# Altium project master-010106.PrjPcb (part 2 of 5)

## Sheet dcdc_5v0_3v3.SchDoc
size 220 x 124 mm; SheetNumber: 1; SheetTotal: 1
Used 2 times, as channels U_03_supply1/MCU_0_VCC, U_03_supply1/MCU_1_VCC. Parts and nets are listed once, with the designators drawn on the sheet.
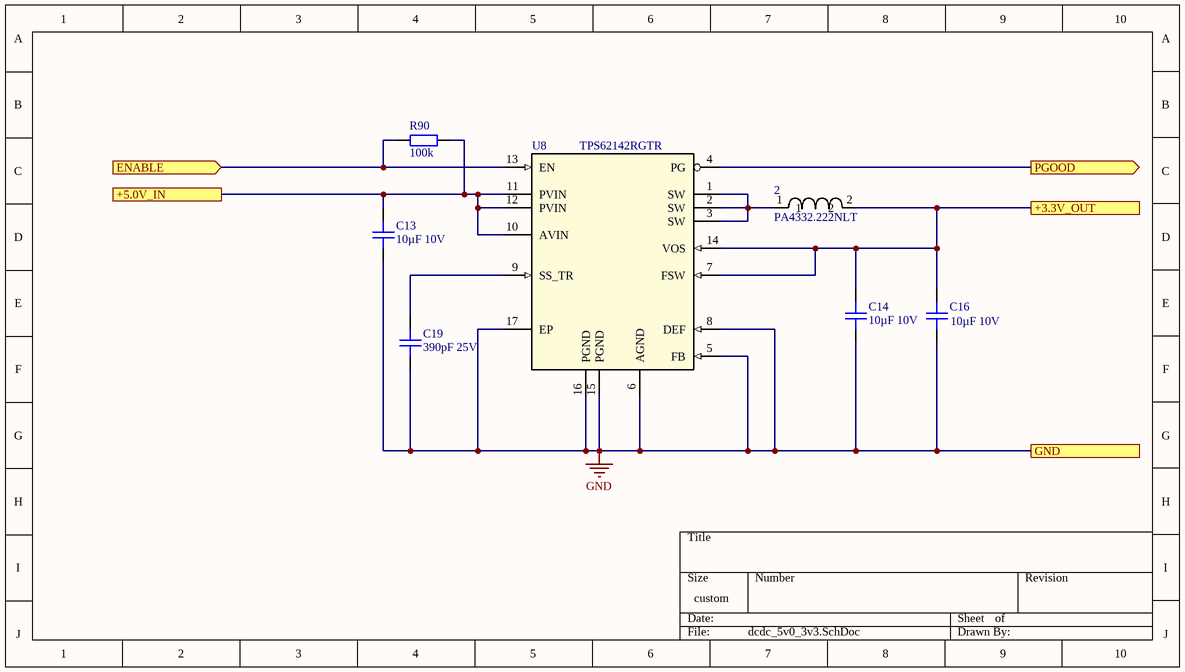
[diagram p5: dcdc_5v0_3v3.SchDoc]

### Parts
2  PA4332.222NLT  [PA4332]
C13  10µF 10V  [0805C]
C14  10µF 10V  [0805C]
C16  10µF 10V  [0805C]
C19  390pF 25V  [0402C]
R90  100k  [0603R]
U8  TPS62142RGTR  [RGT0016C]

### Ports
+3.3V_OUT, +5.0V_IN, ENABLE (in), GND, PGOOD (out)

### Nets
GND: C13.2 C14.2 C16.2 C19.1 U8.5(FB) U8.6(AGND) U8.8(DEF) U8.15(PGND) U8.16(PGND) U8.17(EP) ; port GND
+3.3V_OUT: 2.2 C14.1 C16.1 U8.7(FSW) U8.14(VOS) ; port +3.3V_OUT
+5.0V_IN: C13.1 R90.1 U8.10(AVIN) U8.11(PVIN) U8.12(PVIN) ; port +5.0V_IN
ENABLE: R90.2 U8.13(EN) ; port ENABLE
PGOOD: U8.4(PG) ; port PGOOD
Net2_1: 2.1 U8.1(SW) U8.2(SW) U8.3(SW)
NetC19_2: C19.2 U8.9(SS_TR)

### Channels
U_03_supply1/MCU_0_VCC: designators end in _1; ports +3.3V_OUT=+3.3V_0+ +5.0V_IN=+5.0V_0 ENABLE=+5.0V_0 GND=GND PGOOD=MCU_0_NRESET
U_03_supply1/MCU_1_VCC: designators end in _2; ports +3.3V_OUT=+3.3V_1+ +5.0V_IN=+5.0V_1 ENABLE=+5.0V_1 GND=GND PGOOD=MCU_1_NRESET

### Library data of the parts
2 = PA4332.222NLT: Imported; Vendor: Pulse Engineering; Manufacturer_Part_Number: PA4332.222NLT; RefDes: RefDes; TYPE: TYPE; Value: Value
C13 C14 C16 = gen_C_ceramic_10u_10V_X7R_0805: Ceramic, 10µF, ±10%, 10V, X7R, –55 to 125°C, 0805 (2012),RoHS, Automotive; Part Number: GCJ21BR71A106KE01; Manufacturer: Murata; Case EIA: 0805; Case Metric: 2012; Automotive Qualified: True; PnP Package: C_0805_10; PnP Value: 10µF/10V/X7R; Capacitance: 10µF; Dielectric: X7R; Rated Voltage: 10V; Height - Seated (Max): 1.25mm; Mounting Type: SurfaceMount,MLCC; Operating Temperature: –55 to 125°C; Series: GCJ; Tolerance: ±10%; Manufacturer_Part_Number: GCJ21BR71A106KE01; Supplier 1: Digi-Key; Supplier Part Number 1: 490-12646-1-ND
C19 = gen_C_ceramic_390p_25V_C0G_0402: Ceramic, 390pF, ±5%, 25V, C0G, 25 to 125°C, 0402 (1005),RoHS, Automotive; Part Number: GCM1555C1H180JA16#; Manufacturer: Murata; Capacitance: 18p; Rated Voltage: 50V; Case EIA: 0402; Case Metric: 1005; Automotive Qualified: True; PnP Package: C_0402_10; PnP Value: 18pF/50V/X7R; Dielectric: C0G; Supplier 1: Digi-Key; Supplier Part Number 1: 490-12650-1-ND; Height - Seated (Max): 0.5mm; Mounting Type: SurfaceMount,MLCC; Operating Temperature: 25 to 125°C; Series: GCM; Tolerance: ±5%; Manufacturer_Part_Number: GCM1555C1H180JA16#
R90 = gen_R_100k_0603: as R104 on sheet supply_internal; Operating Temperature: -55°C - +155°C; PnP Value: 100k; Part Number: gen_R_100k_0603
U8 = TPS62142RGTR: Imported; Manufacturer: Texas Instruments; PartNumber: TPS62142RGTR; RefDes: RefDes; TYPE: TYPE; Value: Value

## Sheet dcdc_wide_3v3.SchDoc
size 379 x 125 mm; SheetNumber: 1; SheetTotal: 1
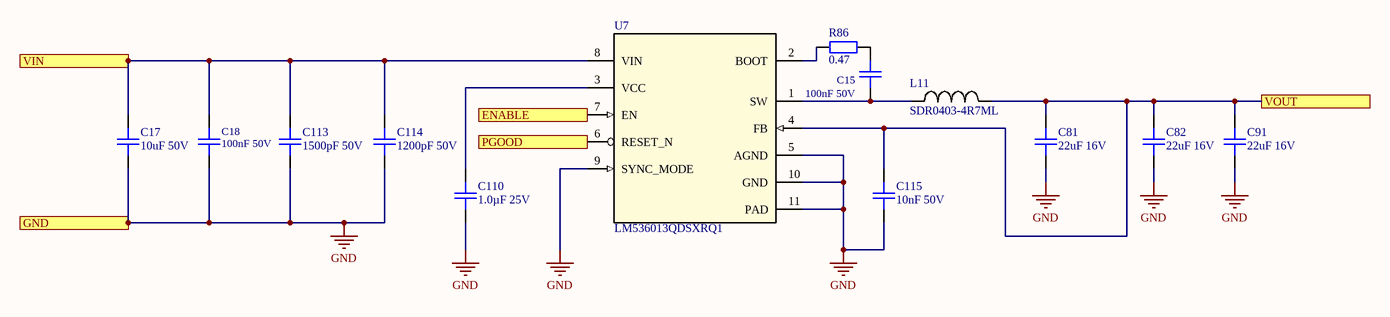
[diagram p6: dcdc_wide_3v3.SchDoc]

### Parts
(Parts that share a designator on the sheet are numbered #1, #2 ... from top to bottom, then left to right.)
C15  100nF 50V  [0805C]
C17  10uF 50V  [CAPC3225X279X50LL20T25]
C18  100nF 50V  [0805C]
C81  22uF 16V  [1210C]
C82  22uF 16V  [1210C]
C91  22uF 16V  [1210C]
C110  1.0µF 25V  [0603C]
C113  1500pF 50V  [0402C]
C114  1200pF 50V  [0402C]
C115  10nF 50V  [0402C]
L11  SDR0403-4R7ML  [SDR0403]
R86#1  0.47  [0402R]
U7  LM536013QDSXRQ1  [DSX0010A]

### Ports
ENABLE, GND, PGOOD, VIN, VOUT

### Nets
+9-30V_IN: C17.2 C18.2 C113.2 C114.2 U7.8(VIN) ; port VIN
EXT_+3.3V_0+: C81.2 C82.2 C91.2 C115.2 L11.2 U7.4(FB) ; port VOUT
GND: C17.1 C18.1 C81.1 C82.1 C91.1 C110.1 C113.1 C114.1 C115.1 U7.5(AGND) U7.9(SYNC_MODE) U7.10(GND) U7.11(PAD) ; port GND
EXT_0.FAULT: U7.7(EN) ; port ENABLE
EXT_+3.3V_0_PG: U7.6(RESET_N) ; port PGOOD
NetC15_1: C15.1 L11.1 U7.1(SW)
NetC15_2: C15.2 R86#1.2
NetC110_2: C110.2 U7.3(VCC)
NetR86#1_1: R86#1.1 U7.2(BOOT)

### Library data of the parts
C15 = gen_C_ceramic_100n_50V_X7R_0805: Ceramic, 100nF, ±20%, 50V, X7R, –55 to 125°C, 0805 (2012),RoHS, Automotive; Part Number: GCJ188R71H104KA12; Manufacturer: Murata; Capacitance: 100n; Case EIA: 0603; Case Metric: 1608; Automotive Qualified: True; PnP Package: C_0603_10; PnP Value: 100nF/50V/X7R; Tolerance: ±10%; Dielectric: X7R; Rated Voltage: 50V; Height - Seated (Max): 0.8mm; Mounting Type: SurfaceMount,MLCC; Operating Temperature: –55 to 125°C; Series: GCJ; Manufacturer_Part_Number: GCJ188R71H104KA12; Supplier 1: Digi-Key; Supplier Part Number 1: 490-5798-1-ND
C17 = gen_C_ceramic_10u_50V_X7R_1210: Ceramic, 10uF, 50 V, -55 to 125 degC, 2-Pin SMD (1210), RoHS, Tape and Reel; Manufacturer: AVX; Manufacturer 1: Kyocera AVX; Manufacturer Part Number 1: 12105C106KAT2A; Dielectric: X7R; Tolerance: ±10%; Load Life: 1000h; Type: CommercialSurfaceMountChip; Temperature Coefficient / Code: +/-15%; Case EIA: 1210; Case Metric: 3225; PnP Package: C_1210_10; PnP Value: 10µF/25V/X7R; Rated Voltage: 25V; Maximum Operating Temperature: +125C; Mounting Technology: SurfaceMount; Case Code - in: 1210; Package Description: 2-Pin Surface Mount Device, Body 3.2 x 2.5 mm; Datasheet URL: http://www.farnell.com/datasheets/1818074.pdf; Case Code - mm: 3225; Package / Case: 1210(3225metric); Product: GeneralTypeMLCCs; Capacitance: 10uF; Product Category: MultilayerCeramicCapacitorsMLCC-SMD/SMT; Minimum Operating Temperature: -55C; Manufacturer URL: http://www.avx.com/; Operating Temperature Range: -55Cto+125C; Termination Style: SMD/SMT; Voltage Rating: 50V; Factory Pack Quantity: 1000; RoHS: Details; Brand: AVX; Datasheet Version: 03/2014; Package Reference: 1210; Packaging: Reel; Voltage Rating DC: 50V; Height - Seated (Max): 2.5mm; Mounting Type: SurfaceMount,MLCC; Operating Temperature: –55 to 125°C; Series: GCM
C18 = gen_C_ceramic_100n_50V_X7R_0805: Ceramic, 100nF, ±20%, 50V, X7R, –55 to 125°C, 0805 (2012),RoHS, Automotive; Manufacturer: Murata; Capacitance: 100n; Case EIA: 0805; Case Metric: 2012; Automotive Qualified: True; PnP Package: C_0805_10; Tolerance: ±10%; Dielectric: X7R; Rated Voltage: 50V; Height - Seated (Max): 0.8mm; Mounting Type: SurfaceMount,MLCC; Operating Temperature: –55 to 125°C; Series: GCJ; Supplier 1: Digi-Key; Supplier Part Number 1: 490-5798-1-ND
C81 C82 C91 = gen_C_ceramic_22u_16V_X7R_1210: Ceramic, 22uF, 16 V, -55 to 125 degC, 2-Pin SMD (1210), RoHS, Tape and Reel; Manufacturer: AVX; Manufacturer 1: Kyocera AVX; Manufacturer Part Number 1: 12105C106KAT2A; Dielectric: X7R; Tolerance: ±10%; Capacitance: 10uF; Load Life: 1000h; Type: CommercialSurfaceMountChip; Voltage Rating: 50V; Temperature Coefficient / Code: +/-15%; Case EIA: 1210; Case Metric: 3225; PnP Package: C_1210_10; PnP Value: 22µF/16V/X7R; Maximum Operating Temperature: +125C; Mounting Technology: SurfaceMount; Case Code - in: 1210; Package Description: 2-Pin Surface Mount Device, Body 3.2 x 2.5 mm; Datasheet URL: http://www.farnell.com/datasheets/1818074.pdf; Case Code - mm: 3225; Package / Case: 1210(3225metric); Product: GeneralTypeMLCCs; Product Category: MultilayerCeramicCapacitorsMLCC-SMD/SMT; Minimum Operating Temperature: -55C; Manufacturer URL: http://www.avx.com/; Operating Temperature Range: -55Cto+125C; Termination Style: SMD/SMT; Factory Pack Quantity: 1000; RoHS: Details; Brand: AVX; Datasheet Version: 03/2014; Package Reference: 1210; Packaging: Reel; Voltage Rating DC: 50V; Height - Seated (Max): 2.5mm; Mounting Type: SurfaceMount,MLCC; Operating Temperature: –55 to 125°C; Rated Voltage: 16V; Series: GCM
C110 = gen_C_ceramic_1u_25V_X7R_0603: Ceramic, 1.0µF, ±10%, 25V, X7R, –55 to 125°C, 0603 (1608),RoHS, Automotive; Part Number: GCJ188R71E105KA01; Manufacturer: Murata; Case EIA: 0603; Case Metric: 1608; Capacitance: 1µF; Automotive Qualified: True; PnP Package: C_0603_10; PnP Value: 1.0µF/25V/X7R; Dielectric: X7R; Rated Voltage: 25V; Height - Seated (Max): 0.8mm; Mounting Type: SurfaceMount,MLCC; Operating Temperature: –55 to 125°C; Series: GCJ; Tolerance: ±10%; Manufacturer_Part_Number: GCJ188R71E105KA01; Supplier 1: Digi-Key; Supplier Part Number 1: 490-14409-1-ND
C113 = gen_C_ceramic_390p_25V_C0G_0402: Ceramic, 390pF, ±5%, 25V, C0G, 25 to 125°C, 0402 (1005),RoHS, Automotive; Manufacturer: Murata; Capacitance: 1500p; Case EIA: 0402; Case Metric: 1005; Automotive Qualified: True; PnP Package: C_0402_10; PnP Value: 1500p/50V/C0G; Rated Voltage: 50V; Dielectric: C0G; Supplier 1: Digi-Key; Height - Seated (Max): 0.5mm; Mounting Type: SurfaceMount,MLCC; Operating Temperature: 25 to 125°C; Series: GCM; Tolerance: ±5%
C114 = gen_C_ceramic_390p_25V_C0G_0402: Ceramic, 390pF, ±5%, 50V, C0G, 25 to 125°C, 0402 (1005),RoHS, Automotive; Manufacturer: Murata; Capacitance: 1200p; Case EIA: 0402; Case Metric: 1005; Automotive Qualified: True; PnP Package: C_0402_10; PnP Value: 1200pF/50V/C0G; Rated Voltage: 50V; Dielectric: C0G; Supplier 1: Digi-Key; Height - Seated (Max): 0.5mm; Mounting Type: SurfaceMount,MLCC; Operating Temperature: 25 to 125°C; Series: GCM; Tolerance: ±5%
C115 = gen_C_ceramic_10n_50V_X7R_0402: Ceramic, 10nF, ±10%, 50V, X7R, –55 to 125°C, 0402 (1005),RoHS, Automotive; Part Number: GRT155R71H104KE01; Automotive Qualified: True; Capacitance: 10n; Case EIA: 0402; Case Metric: 1005; PnP Package: C_0402_10; PnP Value: 10n/50V/X7R; Dielectric: X7R; Rated Voltage: 50V
L11 = SDR0403-4R7ML: 4.7uH; Vendor: Bourns; Manufacturer_Part_Number: SDR0403-4R7ML; Manufacturer_Name: Bourns; RefDes: RefDes; TYPE: TYPE; Value: Value
R86#1 = gen_R_0R_0402: SMD Resistor 0R47 0402; Part Number: gen_R_0R47_0402; Case EIA: 0402; Case Metric: 1005; PnP Package: R_0402; Automotive Qualified: False; PnP Value: 0R47; Operating Temperature: -55°C - +155°C
U7 = LM536013QDSXRQ1: Imported; Manufacturer: Texas Instruments; CompType: IC; PIN_COUNT: 11; Application_BuildNumber: *; PartNumber: LM536013QDSXRQ1; PackageReference: DSX0010A; MountType: SMT; RoHS: Y; RefDes: RefDes; TYPE: TYPE; Value: Value; Manufacturer_Part_Number: LM536013QDSXRQ1; Manufacturer_Name: Texas Instruments

## Sheet supply_external.SchDoc: foxBMS BMS-Master
size A3; DocumentNumber: 2; SheetNumber: 2; SheetTotal: 24; Author: Fraunhofer IISB foxBMS Team; REL-DATE: 2017-05-16; VERSION: 1.0.2; SheetDescription: Supply for MCU0 and peripherals
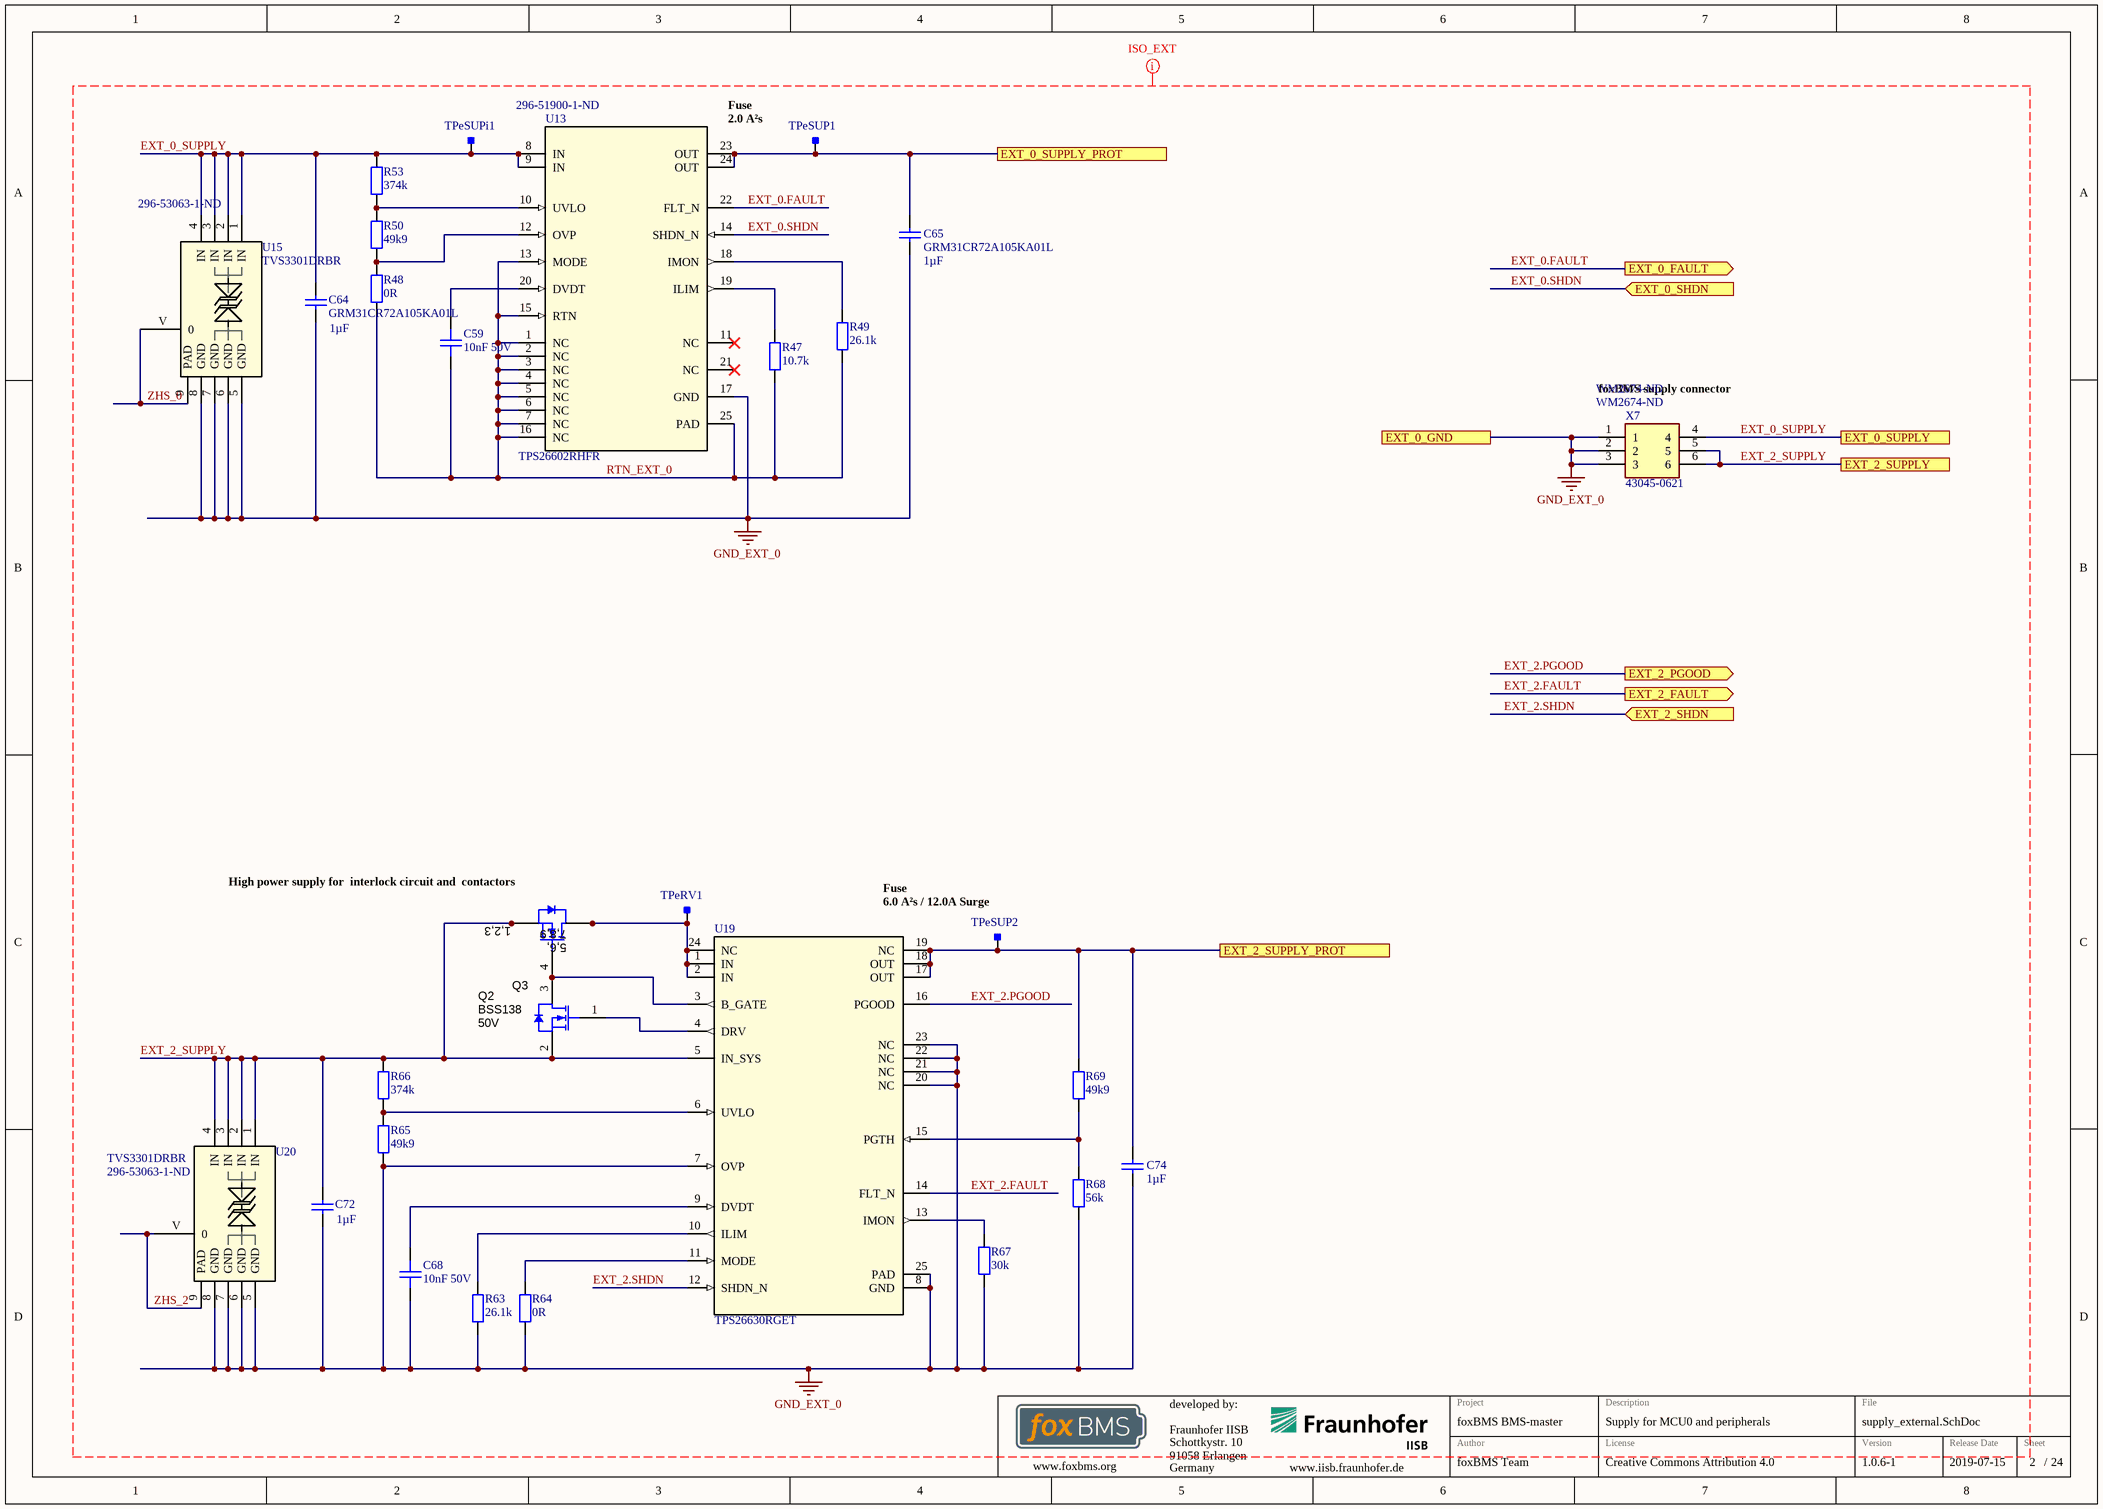
[diagram p7: supply_external.SchDoc]

### Parts
(Parts that share a designator on the sheet are numbered #1, #2 ... from top to bottom, then left to right.)
C59  10nF 50V  [0402C]
C64#1  GRM31CR72A105KA01L  Capacitance: 1µF  [CAPC3216X180X55ML20T25]
C65  GRM31CR72A105KA01L  Capacitance: 1µF  [CAPC3216X180X55ML20T25]
C68#1  10nF 50V  [0402C]
C72  Capacitance: 1µF  [CAPC3216X180X55ML20T25]  (hidden comment: GRM31CR72A105KA01L)
C74#1  Capacitance: 1µF  [CAPC3216X180X55ML20T25]  (hidden comment: GRM31CR72A105KA01L)
Q2  BSS138  value 50V  [SOT-23]
Q3  CSD17308Q3  [SONQ3A]  (value not drawn)
R47#1  10.7k  [0402R]
R48#1  0R  [0402R]
R49#1  26.1k  [0402R]
R50#1  49k9  [0402R]
R53#1  374k  [0402R]
R63#1  26.1k  [0402R]
R64#1  0R  [0402R]
R65#1  49k9  [0402R]
R66#1  374k  [0402R]
R67  30k  [0402R]
R68  56k  [0402R]
R69  49k9  [0402R]
TPeRV1  Testpoint_Square  [Testpoint_S1]  (value not drawn)  (no BOM)
TPeSUP1  Testpoint_Square  [Testpoint_S1]  (value not drawn)  (no BOM)
TPeSUP2  Testpoint_Square  [Testpoint_Keystone_Miniature]  (value not drawn)  (no BOM)
TPeSUPi1  Testpoint_Square  [Testpoint_S1]  (value not drawn)  (no BOM)
U13  TPS26602RHFR  Supplier Part Number 1: 296-51900-1-ND  [RHF0024A]
U15  TVS3301DRBR  Supplier Part Number 1: 296-53063-1-ND  [DRB0008F]
U19  TPS26630RGET  [RGE0024H]
U20  TVS3301DRBR  Supplier Part Number 1: 296-53063-1-ND  [DRB0008F]
X7  43045-0621  Supplier Part Number 1: WM2674-ND  [43045-0621]

### Ports
EXT_0_FAULT (out), EXT_0_GND, EXT_0_SHDN (in), EXT_0_SUPPLY, EXT_0_SUPPLY_PROT, EXT_2_FAULT (out), EXT_2_PGOOD (out), EXT_2_SHDN (in), EXT_2_SUPPLY, EXT_2_SUPPLY_PROT

### Nets
+9-30V_IN: C65.2 TPeSUP1.1 U13.23(OUT) U13.24(OUT) ; port EXT_0_SUPPLY_PROT
GND_EXT_0: C64#1.1 C65.1 C68#1.2 C72.1 C74#1.1 R63#1.1 R64#1.1 R65#1.1 R67.1 R68.1 U13.17(GND) U15.5(GND) U15.6(GND) U15.7(GND) U15.8(GND) U19.7(OVP) U19.8(GND) U19.20(NC) U19.21(NC) U19.22(NC) U19.23(NC) U19.25(PAD) U20.5(GND) U20.6(GND) U20.7(GND) U20.8(GND) X7.1 X7.2 X7.3 ; port EXT_0_GND  [project net GND]
SUPPLY_ext: C74#1.2 R69.2 TPeSUP2.1 U19.17(OUT) U19.18(OUT) U19.19(NC) ; port EXT_2_SUPPLY_PROT
EXT_0.FAULT: U13.22(FLT_N) ; port EXT_0_FAULT
EXT_0.SHDN: U13.14(SHDN_N) ; port EXT_0_SHDN
EXT_0_SUPPLY: C64#1.2 R53#1.2 TPeSUPi1.1 U13.8(IN) U13.9(IN) U15.1(IN) U15.2(IN) U15.3(IN) U15.4(IN) X7.4 ; port EXT_0_SUPPLY
EXT_2.FAULT: U19.14(FLT_N) ; port EXT_2_FAULT  [project net CONTACTOR_SUPPLY_FAULT_EXT]
EXT_2.PGOOD: U19.16(PGOOD) ; port EXT_2_PGOOD
EXT_2.SHDN: U19.12(SHDN_N) ; port EXT_2_SHDN  [project net CONTACTOR_SUPPLY_SHDN_EXT]
EXT_2_SUPPLY: C72.2 Q2.2(S) Q3.1(S) Q3.2(S) Q3.3(S) R66#1.2 U19.5(IN_SYS) U20.1(IN) U20.2(IN) U20.3(IN) U20.4(IN) X7.5 X7.6 ; port EXT_2_SUPPLY
RTN_EXT_0: C59.2 R47#1.1 R48#1.1 R49#1.1 U13.1(NC) U13.2(NC) U13.3(NC) U13.4(NC) U13.5(NC) U13.6(NC) U13.7(NC) U13.13(MODE) U13.15(RTN) U13.16(NC) U13.25(PAD)
ZHS_0: U15.9(PAD) U15.V(0)
ZHS_2: U20.9(PAD) U20.V(0)
NetC59_1: C59.1 U13.20(DVDT)
NetC68#1_1: C68#1.1 U19.9(DVDT)
NetQ2_1: Q2.1(G) U19.4(DRV)
NetQ2_3: Q2.3(D) Q3.4(G) U19.3(B_GATE)
NetQ3_5: Q3.5(D) Q3.6(D) Q3.7(D) Q3.8(D) Q3.9(D) TPeRV1.1 U19.1(IN) U19.2(IN) U19.24(NC)
NetR47#1_2: R47#1.2 U13.19(ILIM)
NetR48#1_2: R48#1.2 R50#1.1 U13.12(OVP)
NetR49#1_2: R49#1.2 U13.18(IMON)
NetR50#1_2: R50#1.2 R53#1.1 U13.10(UVLO)
NetR63#1_2: R63#1.2 U19.10(ILIM)
NetR64#1_2: R64#1.2 U19.11(MODE)
NetR65#1_2: R65#1.2 R66#1.1 U19.6(UVLO)
NetR67_2: R67.2 U19.13(IMON)
NetR68_2: R68.2 R69.1 U19.15(PGTH)

Not connected (* = marked no-connect by the designer): U13 11(NC)* 21(NC)*

### Layout directives
net class ISO_EXT: EXT_0.FAULT, EXT_0.SHDN, EXT_0_SUPPLY, EXT_2.FAULT, EXT_2.PGOOD, EXT_2.SHDN, EXT_2_SUPPLY, GND_EXT_0, RTN_EXT_0, ZHS_0, ZHS_2

### Notes on the sheet
- Fuse
- 2.0 A²s
- (near X7) foxBMS supply connector
- (near Q3) High power supply for
  interlock circuit and
  contactors
- 6.0 A²s / 12.0A Surge
- Fraunhofer IISB
- Schottkystr. 10
- developed by:
- 91058 Erlangen
- Germany
- Author
- Project
- License
- Description
- File
- Version
- Release Date
- Sheet
- www.foxbms.org
- www.iisb.fraunhofer.de
- foxBMS Team
- /
- (in symbol CSD17308Q3) 1,2,3; 7,8,9; 5,6,

### Library data of the parts
C59 C68#1 = gen_C_ceramic_10n_50V_X7R_0402: as C115 on sheet dcdc_wide_3v3; Dielectric: X7R; Rated Voltage: 50V
C64#1 C65 C72 C74#1 = gen_C_ceramic_1u_100V_X7R_1206: Chip Capacitor, 1 uF, +/- 10%, 100 V, -55 to 125 degC, 1206 (3216 Metric), RoHS, Tape and Reel; Manufacturer: Murata; Catalog Drawings: GRMSeries_1206_1.6; Featured Product: GA3SafetyRecognizedCapsandHi-CapMLCC; Online Catalog: GRMSeries; Temperature Coefficient: X7R; Product Training Modules: High-CapMultilayerCeramicCapacitors; Other Names: 490-3909-6; Voltage - Rated: 100V; Case EIA: 1206; PnP Package: C_1206_10; PnP Value: 1.0µF/100V/X7R; Height - Seated (Max): -; Features: -; Applications: GeneralPurpose; Manufacturer URL: http://www.murata.com/; Standard Package: 1; Package Reference: 1206; Series: GRM; Package / Case: 1206(3216Metric); Datasheet Version: Sep-11; Ratings: -; Category: Capacitors; Datasheet URL: https://datasheet.ciiva.com/29199/454987-da-01-en-vs-kondensator-1206-29199435.pdf; Operating Temperature: -55degC~125degC; Lead Spacing: -; Family: CeramicCapacitors; Tolerance: ±10%; Packaging: Digi-Reel; Mounting Type: SurfaceMount,MLCC; Package Description: 2-Pin Surface Mount Device, Body 3.2 x 1.6 mm; Lead Style: -; Thickness (Max): 0.071"(1.80mm); Size / Dimension: 0.126"Lx0.063"W(3.20mmx1.60mm); Dielectric: X7R; Rated Voltage: 100V
Q2 = BSS138: MOSFET, N-CH, 50V, 0.22A, SOT-23; Manufacturer: Fairchild Semiconductor; Alternate Manufacturer: None; U/M: EA; ChType: N; VdsMax_V: 50; Value1: 6 ohm; Rdson45_Ohm: 6; Value2: 1.7 nC; QgTyp_nC: 1.7; Vgs_V: 20; IdsMax_A: 0.22; ComponentLink1URL: http://www.fairchildsemi.com/ds/BS/BSS138.pdf; SymbolVersion: 2008-07-28; PackageReference: SOT-23; PartNumber: BSS138; ComponentLink1Description: Datasheet link; CompType: MOSFET; RoHS: Y; MountType: SMT; Published: 2008-06-19; Publisher: Texas Instruments; LatestRevisionDate: 2013-07-10; LatestRevisionNote: Added parts.; Supplier 1: Digi-Key; Supplier Part Number 1: BSS138CT-ND; Supplier 2: Mouser; Supplier Part Number 2: 512-BSS138; Supplier 3: Farnell; Supplier Part Number 3: 9845330
Q3 = CSD17308Q3: MOSFET, N-CH, 30V, 47A, SON 3.3x3.3mm; Manufacturer: Texas Instruments; Alternate Manufacturer: None; U/M: EA; ChType: N; VdsMax_V: 30; Value1: 0.0094 ohm; Rdson45_Ohm: 0.0094; Value2: 3.9 nC; QgTyp_nC: 3.9; Vgs_V: 10; IdsMax_A: 47; SymbolVersion: 2008-07-09; CompType: MOSFET; Value: 30V; PartNumber: CSD17308Q3; PackageReference: SON 3.3x3.3mm; RoHS: Y; MountType: SMT; Published: 2008-06-19; Publisher: Texas Instruments; LatestRevisionDate: 2013-07-24; LatestRevisionNote: Added parts.; ComponentLink1Description: Datasheet link; ComponentLink1URL: http://www.ti.com/lit/ds/symlink/csd17308q3.pdf; Supplier 1: Digi-Key; Supplier Part Number 1: 296-27210-1-ND; Supplier 2: Mouser; Supplier Part Number 2: 595-CSD17308Q3; Supplier 3: Farnell; Supplier Part Number 3: 1892457
R47#1 = gen_R_10K7_0402: SMD Resistor 10.7k 0402; Part Number: gen_R_10.7k_0402; Case EIA: 0402; Case Metric: 1005; PnP Package: R_0402; Automotive Qualified: False; PnP Value: 10.7k; Operating Temperature: -55°C - +155°C
R48#1 R64#1 = gen_R_0R_0402: SMD Resistor 0R 0402; Case EIA: 0402; Case Metric: 1005; PnP Package: R_0402; Automotive Qualified: False; PnP Value: 0R; Part Number: gen_R_0R_0402; Operating Temperature: -55°C - +155°C
R49#1 R63#1 = gen_R_26k1_0402: SMD Resistor 26.1k 0402; Part Number: gen_R_26.1k_0402; Case EIA: 0402; Case Metric: 1005; PnP Package: R_0402; Automotive Qualified: False; PnP Value: 26.1k; Operating Temperature: -55°C - +155°C
R50#1 R65#1 R69 = gen_R_49k9_0402: SMD Resistor 49.9k 0402; Case EIA: 0402; Case Metric: 1005; PnP Package: R_0402; Automotive Qualified: False; PnP Value: 49k9; Operating Temperature: -55°C - +155°C; Part Number: gen_R_49k9_0402
R53#1 R66#1 = gen_R_374k_0402: SMD Resistor 374k 0402; Case EIA: 0402; Case Metric: 1005; PnP Package: R_0402; Automotive Qualified: False; PnP Value: 374k; Operating Temperature: -55°C - +155°C; Part Number: gen_R_374k_0402
R67 = gen_R_10K7_0402: SMD Resistor 30k 0402; Part Number: gen_R_10.7k_0402; Case EIA: 0402; Case Metric: 1005; PnP Package: R_0402; PnP Value: 10.7k; Automotive Qualified: False; Operating Temperature: -55°C - +155°C
R68 = gen_R_49k9_0402: SMD Resistor 49.9k 0402; Case EIA: 0402; Case Metric: 1005; PnP Package: R_0402; PnP Value: 49k9; Automotive Qualified: False; Operating Temperature: -55°C - +155°C; Part Number: gen_R_49k9_0402
TPeRV1 TPeSUP1 TPeSUP2 TPeSUPi1 = Testpoint_Square: Testpoint, square; Part Number: Testpoint_Square
U13 = TPS26602RHFR: 37V Clamped input protection; Manufacturer: Texas Instruments; PartNumber: TPS26602RHFR; RefDes: RefDes; TYPE: TYPE; Value: Value; Part Number: TPS26602RHFR; Supplier 1: Digi-Key
U15 U20 = TVS3301DRVR: TVS3301 33-V Bidirectional Flat-Clamp Surge Protection Device; Manufacturer: Texas Instruments; Part Number: TVS3301DRBR; RefDes: RefDes; TYPE: TYPE; Value: Value; Supplier 1: Digi-Key
U19 = TPS26630RGET: Imported; Manufacturer: Texas Instruments; PartNumber: TPS26630RGER; RefDes: RefDes; TYPE: TYPE; Value: Value
X7 = 43045-0621: Micro-Fit 3.0 Right Angle Header, 3.00mm Pitch, Dual Row, 6 Circuits, with Snap-in Plastic Peg PCB Lock, Tin, Glow Wire Capable, Black, 43045-0621; Manufacturer_Name: Molex; Part Name: MicroFit; Circuits: 6; Datasheet Link: http://www.molex.com/webdocs/datasheets/pdf/en-us//0430450621_PCB_HEADERS.pdf; Height: 8mm; Manufacturer_Part_Number: 43045-0621; Mouser Part Number: 538-43045-0621; Mouser Price/Stock: https://www.mouser.com/Search/Refine.aspx?Keyword=538-43045-0621; RS Part Number: 6700380; RS Price/Stock: https://uk.rs-online.com/web/p/products/6700380; Supplier 1: Digi-Key; Supplier 2: Digi-Key; Supplier Part Number 2: WM2674-ND

## Sheet mcu0_primary.SchDoc: foxBMS BMS-Master
size A3; DocumentNumber: 4; SheetNumber: 4; SheetTotal: 24; Author: Fraunhofer IISB foxBMS Team; REL-DATE: 2017-05-16; VERSION: 1.0.2; SheetDescription: MCU0 (Primary); ClassName: ISO_MCU
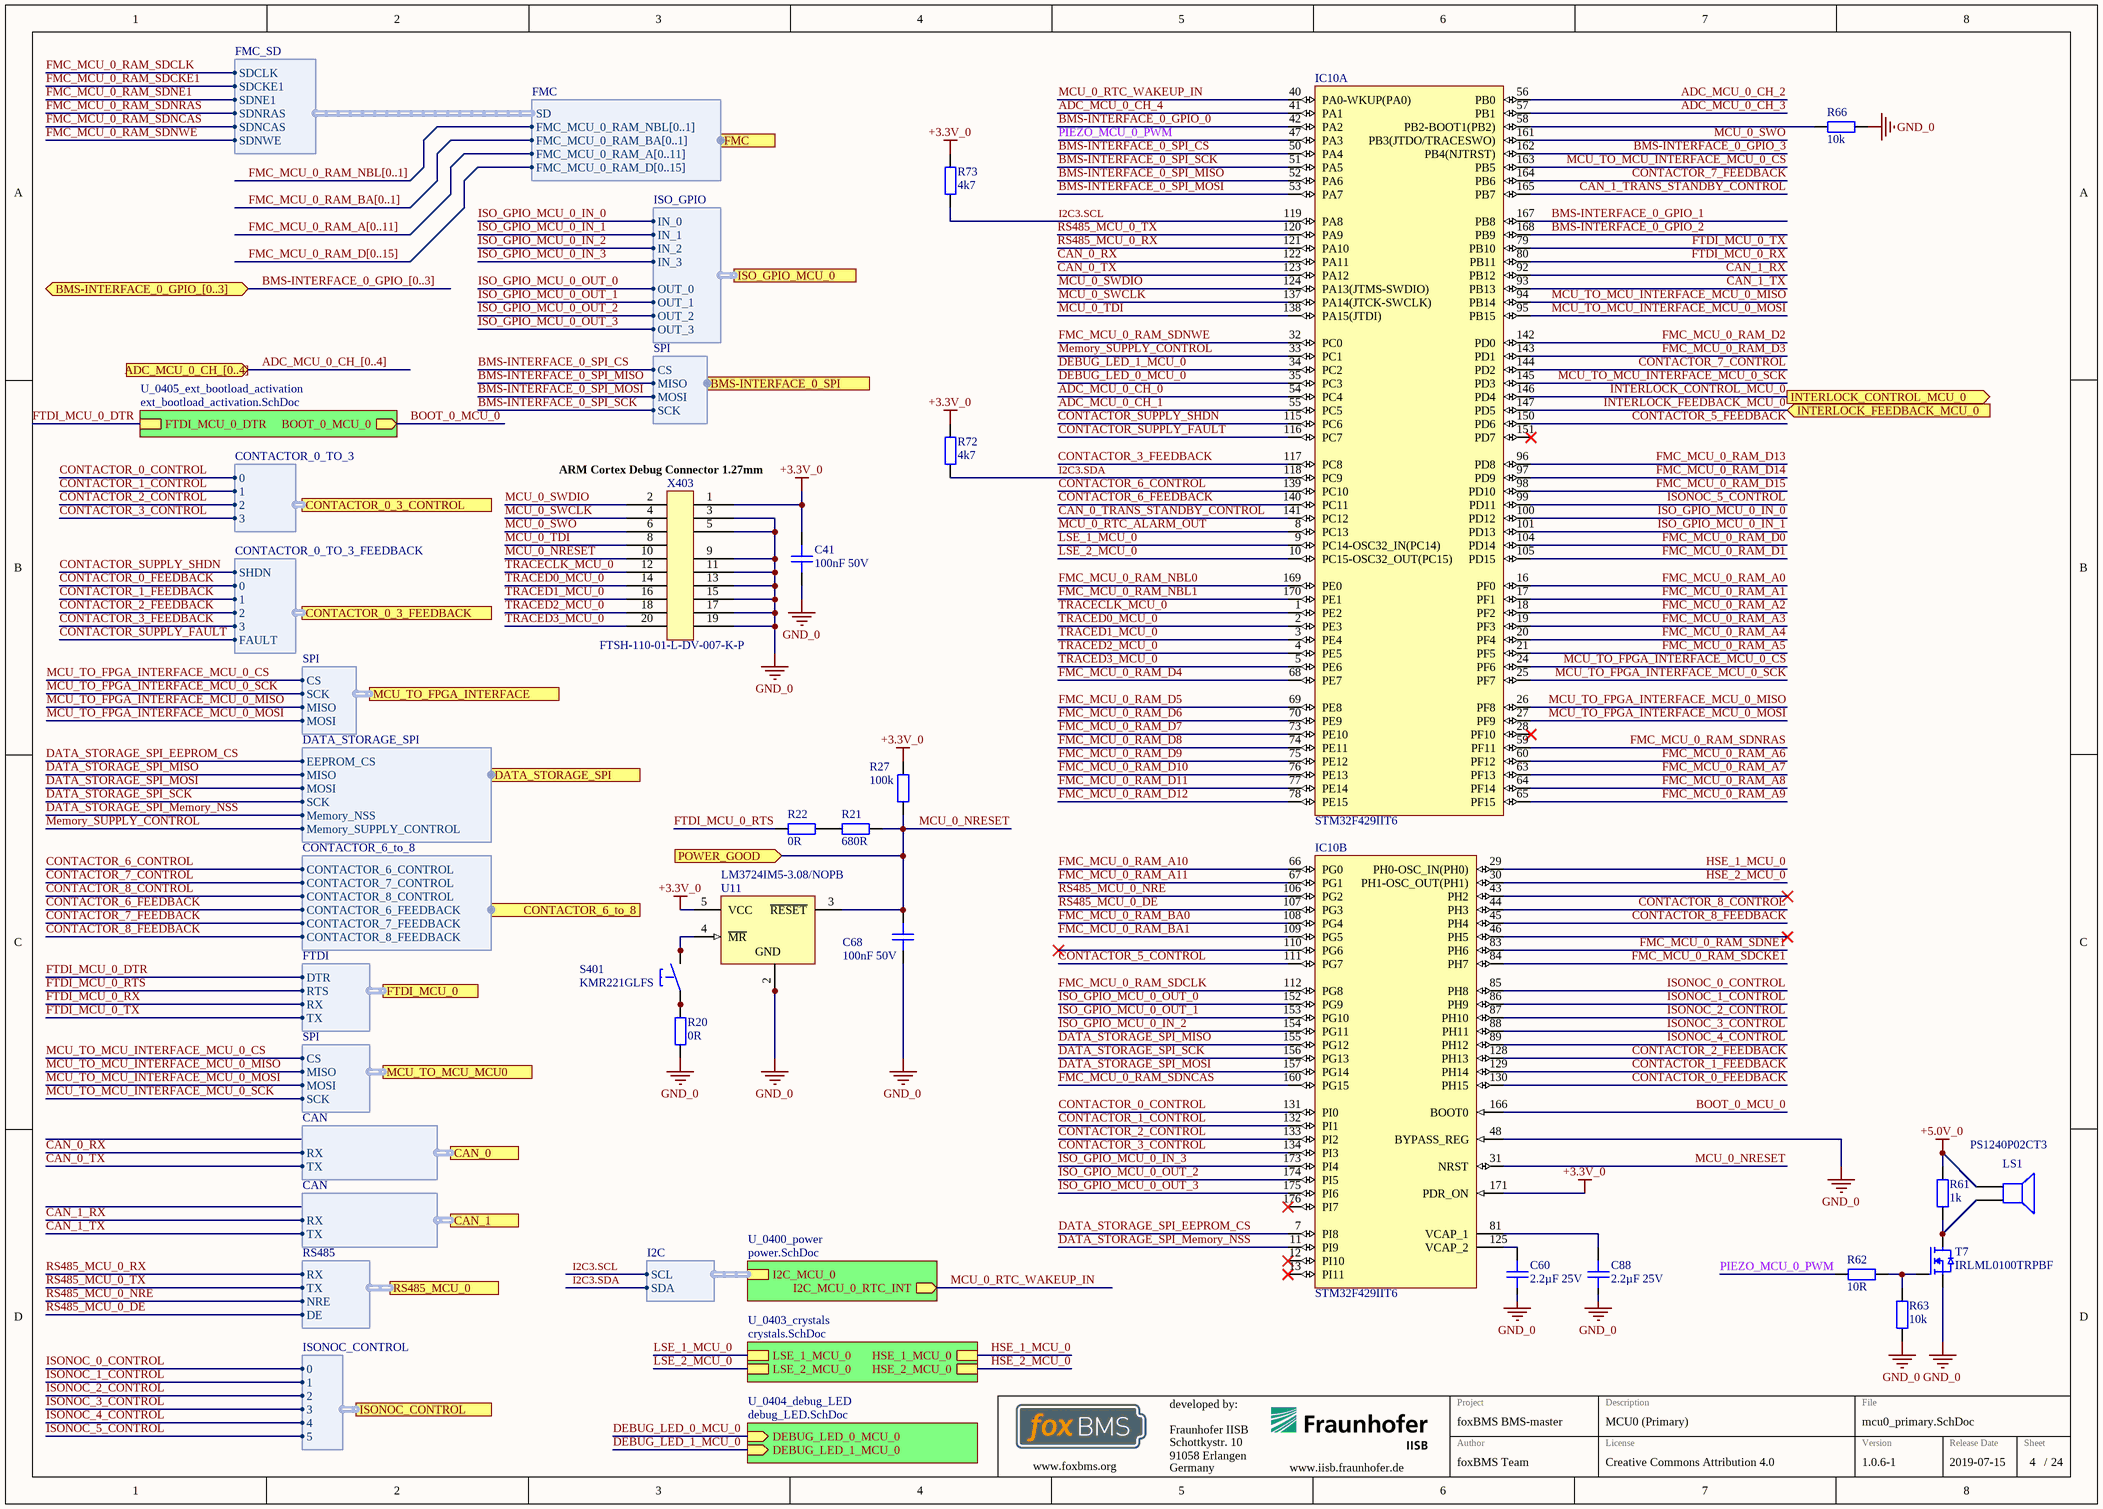
[diagram p8: mcu0_primary.SchDoc]

### Parts
(Parts that share a designator on the sheet are numbered #1, #2 ... from top to bottom, then left to right.)
C41  100nF 50V  [0603C]
C60  2.2µF 25V  [0805C]
C68#2  100nF 50V  [0603C]
C88  2.2µF 25V  [0805C]
IC10  STM32F429IIT6  [STM-LQFP176_N]  (parts A,B of 3)
LS1  PS1240P02CT3  [PS12]
R20  0R  [0603R]
R21  680R  [0603R]
R22  0R  [0603R]
R27  100k  [0603R]
R61  1k  [0603R]
R62#2  10R  [0603R]
R63#2  10k  [0603R]
R66#2  10k  [0603R]
R72#1  4k7  [0603R]
R73  4k7  [0603R]
S401  KMR221GLFS  [KMR2_Series]
T7#1  IRLML0100TRPBF  [SOT95P237X110-3N]
U11#1  LM3724IM5-3.08/NOPB  [MF05A_N]
X403  FTSH-110-01-L-DV-007-K-P  [CORTEX_DEBUG_20_PIN]

### Sub-sheets
U_0400_power = power.SchDoc: I2C_MCU_0_RTC_INT (out), I2C_MCU_0 (harness I2C)
U_0403_crystals = crystals.SchDoc: LSE_1_MCU_0, LSE_2_MCU_0, HSE_1_MCU_0, HSE_2_MCU_0
U_0404_debug_LED = debug_LED.SchDoc: DEBUG_LED_0_MCU_0 (in), DEBUG_LED_1_MCU_0 (in)
U_0405_ext_bootload_activation = ext_bootload_activation.SchDoc: FTDI_MCU_0_DTR, BOOT_0_MCU_0 (out)

### Ports
ADC_MCU_0_CH_[0..4] (in), BMS-INTERFACE_0_GPIO_[0..3] (bidir, harness CAN), BMS-INTERFACE_0_SPI (harness SPI), CAN_0 (harness CAN), CAN_1 (harness CAN), CONTACTOR_0_3_CONTROL (harness CONTACTOR_0_TO_3), CONTACTOR_0_3_FEEDBACK (harness CONTACTOR_0_TO_3_FEEDBACK), CONTACTOR_6_to_8 (harness CONTACTOR_6_to_8), DATA_STORAGE_SPI (harness DATA_STORAGE_SPI), FMC (harness FMC), FTDI_MCU_0 (harness FTDI), INTERLOCK_CONTROL_MCU_0 (out), INTERLOCK_FEEDBACK_MCU_0 (in), ISO_GPIO_MCU_0 (harness ISO_GPIO), ISONOC_CONTROL (harness ISONOC_CONTROL), MCU_TO_FPGA_INTERFACE (harness SPI), MCU_TO_MCU_MCU0 (harness SPI), POWER_GOOD (in), RS485_MCU_0 (harness RS485)

### Harnesses
FMC_SD: SDCLK, SDCKE1, SDNE1, SDNRAS, SDNWE, SDNCAS
FMC: SD, FMC_MCU_0_RAM_NBL[0..1], FMC_MCU_0_RAM_BA[0..1], FMC_MCU_0_RAM_A[0..11], FMC_MCU_0_RAM_D[0..15]
SPI: CS, SCK, MISO, MOSI
DATA_STORAGE_SPI: EEPROM_CS, MISO, MOSI, SCK, Memory_NSS, Memory_SUPPLY_CONTROL
CONTACTOR_6_to_8: CONTACTOR_6_CONTROL, CONTACTOR_7_CONTROL, CONTACTOR_8_CONTROL, CONTACTOR_6_FEEDBACK, CONTACTOR_7_FEEDBACK, CONTACTOR_8_FEEDBACK
SPI: CS, MISO, MOSI, SCK
FTDI: DTR, RTS, RX, TX
CAN: RX, TX
RS485: RX, TX, NRE, DE
ISONOC_CONTROL: 0, 1, 2, 3, 4, 5
ISO_GPIO: IN_0, IN_1, IN_2, IN_3, OUT_3, OUT_0, OUT_1, OUT_2
CONTACTOR_0_TO_3: 0, 1, 2, 3
CONTACTOR_0_TO_3_FEEDBACK: 0, 1, 2, 3, FAULT, SHDN
I2C: SDA, SCL

### Nets
+3.3V_0: C41.1 IC10.171(PDR_ON) R27.2 R72#1.2 R73.2 U11#1.5(VCC) X403.1
+5.0V_0: LS1.1 R61.2
GND_0: C41.2 C60.2 C68#2.2 C88.2 IC10.48(BYPASS_REG) R20.1 R63#2.1 R66#2.1 T7#1.S U11#1.1(GND) U11#1.2(GND) X403.3 X403.5 X403.9 X403.11 X403.13 X403.15 X403.17 X403.19  [project net GND]
ADC_MCU_0_CH_0: IC10.54(PC4)
ADC_MCU_0_CH_1: IC10.55(PC5)
ADC_MCU_0_CH_2: IC10.56(PB0)
ADC_MCU_0_CH_3: IC10.57(PB1)
ADC_MCU_0_CH_4: IC10.41(PA1)
BMS-INTERFACE_0_GPIO_0: IC10.42(PA2)
BMS-INTERFACE_0_GPIO_1: IC10.167(PB8)
BMS-INTERFACE_0_GPIO_2: IC10.168(PB9)
BMS-INTERFACE_0_GPIO_3: IC10.162(PB4(NJTRST))
BMS-INTERFACE_0_SPI_CS: IC10.50(PA4) ; port BMS-INTERFACE_0_SPI.CS
BMS-INTERFACE_0_SPI_MISO: IC10.52(PA6) ; port BMS-INTERFACE_0_SPI.MISO
BMS-INTERFACE_0_SPI_MOSI: IC10.53(PA7) ; port BMS-INTERFACE_0_SPI.MOSI
BMS-INTERFACE_0_SPI_SCK: IC10.51(PA5) ; port BMS-INTERFACE_0_SPI.SCK
BOOT_0_MCU_0: IC10.166(BOOT0) ; sheet U_0405_ext_bootload_activation/BOOT_0_MCU_0
CAN_0_RX: IC10.122(PA11) ; port CAN_0.RX
CAN_0_TRANS_STANDBY_CONTROL: IC10.141(PC12)
CAN_0_TX: IC10.123(PA12) ; port CAN_0.TX
CAN_1_RX: IC10.92(PB12) ; port CAN_1.RX
CAN_1_TRANS_STANDBY_CONTROL: IC10.165(PB7)
CAN_1_TX: IC10.93(PB13) ; port CAN_1.TX
CONTACTOR_0_CONTROL: IC10.131(PI0) ; port CONTACTOR_0_3_CONTROL.0
CONTACTOR_0_FEEDBACK: IC10.130(PH15) ; port CONTACTOR_0_3_FEEDBACK.0
CONTACTOR_1_CONTROL: IC10.132(PI1) ; port CONTACTOR_0_3_CONTROL.1
CONTACTOR_1_FEEDBACK: IC10.129(PH14) ; port CONTACTOR_0_3_FEEDBACK.1
CONTACTOR_2_CONTROL: IC10.133(PI2) ; port CONTACTOR_0_3_CONTROL.2
CONTACTOR_2_FEEDBACK: IC10.128(PH13) ; port CONTACTOR_0_3_FEEDBACK.2
CONTACTOR_3_CONTROL: IC10.134(PI3) ; port CONTACTOR_0_3_CONTROL.3
CONTACTOR_3_FEEDBACK: IC10.117(PC8) ; port CONTACTOR_0_3_FEEDBACK.3
CONTACTOR_5_CONTROL: IC10.111(PG7)
CONTACTOR_5_FEEDBACK: IC10.150(PD6)
CONTACTOR_6_CONTROL: IC10.139(PC10) ; port CONTACTOR_6_to_8.CONTACTOR_6_CONTROL
CONTACTOR_6_FEEDBACK: IC10.140(PC11) ; port CONTACTOR_6_to_8.CONTACTOR_6_FEEDBACK
CONTACTOR_7_CONTROL: IC10.144(PD2) ; port CONTACTOR_6_to_8.CONTACTOR_7_CONTROL
CONTACTOR_7_FEEDBACK: IC10.164(PB6) ; port CONTACTOR_6_to_8.CONTACTOR_7_FEEDBACK
CONTACTOR_8_CONTROL: IC10.44(PH3) ; port CONTACTOR_6_to_8.CONTACTOR_8_CONTROL
CONTACTOR_8_FEEDBACK: IC10.45(PH4) ; port CONTACTOR_6_to_8.CONTACTOR_8_FEEDBACK
CONTACTOR_SUPPLY_FAULT: IC10.116(PC7) ; port CONTACTOR_0_3_FEEDBACK.FAULT
CONTACTOR_SUPPLY_SHDN: IC10.115(PC6) ; port CONTACTOR_0_3_FEEDBACK.SHDN
DATA_STORAGE_SPI_EEPROM_CS: IC10.7(PI8) ; port DATA_STORAGE_SPI.EEPROM_CS
DATA_STORAGE_SPI_Memory_NSS: IC10.11(PI9) ; port DATA_STORAGE_SPI.Memory_NSS
DATA_STORAGE_SPI_MISO: IC10.155(PG12) ; port DATA_STORAGE_SPI.MISO
DATA_STORAGE_SPI_MOSI: IC10.157(PG14) ; port DATA_STORAGE_SPI.MOSI
DATA_STORAGE_SPI_SCK: IC10.156(PG13) ; port DATA_STORAGE_SPI.SCK
DEBUG_LED_0_MCU_0: IC10.35(PC3) ; sheet U_0404_debug_LED/DEBUG_LED_0_MCU_0
DEBUG_LED_1_MCU_0: IC10.34(PC2) ; sheet U_0404_debug_LED/DEBUG_LED_1_MCU_0
FMC_MCU_0_RAM_A0: IC10.16(PF0)
FMC_MCU_0_RAM_A1: IC10.17(PF1)
FMC_MCU_0_RAM_A2: IC10.18(PF2)
FMC_MCU_0_RAM_A3: IC10.19(PF3)
FMC_MCU_0_RAM_A4: IC10.20(PF4)
FMC_MCU_0_RAM_A5: IC10.21(PF5)
FMC_MCU_0_RAM_A6: IC10.60(PF12)
FMC_MCU_0_RAM_A7: IC10.63(PF13)
FMC_MCU_0_RAM_A8: IC10.64(PF14)
FMC_MCU_0_RAM_A9: IC10.65(PF15)
FMC_MCU_0_RAM_A10: IC10.66(PG0)
FMC_MCU_0_RAM_A11: IC10.67(PG1)
FMC_MCU_0_RAM_BA0: IC10.108(PG4)
FMC_MCU_0_RAM_BA1: IC10.109(PG5)
FMC_MCU_0_RAM_D0: IC10.104(PD14)
FMC_MCU_0_RAM_D1: IC10.105(PD15)
FMC_MCU_0_RAM_D2: IC10.142(PD0)
FMC_MCU_0_RAM_D3: IC10.143(PD1)
FMC_MCU_0_RAM_D4: IC10.68(PE7)
FMC_MCU_0_RAM_D5: IC10.69(PE8)
FMC_MCU_0_RAM_D6: IC10.70(PE9)
FMC_MCU_0_RAM_D7: IC10.73(PE10)
FMC_MCU_0_RAM_D8: IC10.74(PE11)
FMC_MCU_0_RAM_D9: IC10.75(PE12)
FMC_MCU_0_RAM_D10: IC10.76(PE13)
FMC_MCU_0_RAM_D11: IC10.77(PE14)
FMC_MCU_0_RAM_D12: IC10.78(PE15)
FMC_MCU_0_RAM_D13: IC10.96(PD8)
FMC_MCU_0_RAM_D14: IC10.97(PD9)
FMC_MCU_0_RAM_D15: IC10.98(PD10)
FMC_MCU_0_RAM_NBL0: IC10.169(PE0)
FMC_MCU_0_RAM_NBL1: IC10.170(PE1)
FMC_MCU_0_RAM_SDCKE1: IC10.84(PH7) ; harness FMC_SD.SDCKE1
FMC_MCU_0_RAM_SDCLK: IC10.112(PG8) ; harness FMC_SD.SDCLK
FMC_MCU_0_RAM_SDNCAS: IC10.160(PG15) ; harness FMC_SD.SDNCAS
FMC_MCU_0_RAM_SDNE1: IC10.83(PH6) ; harness FMC_SD.SDNE1
FMC_MCU_0_RAM_SDNRAS: IC10.59(PF11) ; harness FMC_SD.SDNRAS
FMC_MCU_0_RAM_SDNWE: IC10.32(PC0) ; harness FMC_SD.SDNWE
FTDI_MCU_0_DTR: sheet U_0405_ext_bootload_activation/FTDI_MCU_0_DTR, port FTDI_MCU_0.DTR
FTDI_MCU_0_RTS: R22.2 ; port FTDI_MCU_0.RTS
FTDI_MCU_0_RX: IC10.80(PB11) ; port FTDI_MCU_0.RX
FTDI_MCU_0_TX: IC10.79(PB10) ; port FTDI_MCU_0.TX
HSE_1_MCU_0: IC10.29(PH0-OSC_IN(PH0)) ; sheet U_0403_crystals/HSE_1_MCU_0
HSE_2_MCU_0: IC10.30(PH1-OSC_OUT(PH1)) ; sheet U_0403_crystals/HSE_2_MCU_0
I2C3.SCL: IC10.119(PA8) R73.1 ; sheet U_0400_power/I2C_MCU_0.SCL
I2C3.SDA: IC10.118(PC9) R72#1.1 ; sheet U_0400_power/I2C_MCU_0.SDA
INTERLOCK_CONTROL_MCU_0: IC10.146(PD4) ; port INTERLOCK_CONTROL_MCU_0
INTERLOCK_FEEDBACK_MCU_0: IC10.147(PD5) ; port INTERLOCK_FEEDBACK_MCU_0
ISO_GPIO_MCU_0_IN_0: IC10.100(PD12) ; port ISO_GPIO_MCU_0.IN_0
ISO_GPIO_MCU_0_IN_1: IC10.101(PD13) ; port ISO_GPIO_MCU_0.IN_1
ISO_GPIO_MCU_0_IN_2: IC10.154(PG11) ; port ISO_GPIO_MCU_0.IN_2
ISO_GPIO_MCU_0_IN_3: IC10.173(PI4) ; port ISO_GPIO_MCU_0.IN_3
ISO_GPIO_MCU_0_OUT_0: IC10.152(PG9) ; port ISO_GPIO_MCU_0.OUT_0
ISO_GPIO_MCU_0_OUT_1: IC10.153(PG10) ; port ISO_GPIO_MCU_0.OUT_1
ISO_GPIO_MCU_0_OUT_2: IC10.174(PI5) ; port ISO_GPIO_MCU_0.OUT_2
ISO_GPIO_MCU_0_OUT_3: IC10.175(PI6) ; port ISO_GPIO_MCU_0.OUT_3
ISONOC_0_CONTROL: IC10.85(PH8) ; port ISONOC_CONTROL.0
ISONOC_1_CONTROL: IC10.86(PH9) ; port ISONOC_CONTROL.1
ISONOC_2_CONTROL: IC10.87(PH10) ; port ISONOC_CONTROL.2
ISONOC_3_CONTROL: IC10.88(PH11) ; port ISONOC_CONTROL.3
ISONOC_4_CONTROL: IC10.89(PH12) ; port ISONOC_CONTROL.4
ISONOC_5_CONTROL: IC10.99(PD11) ; port ISONOC_CONTROL.5
LSE_1_MCU_0: IC10.9(PC14-OSC32_IN(PC14)) ; sheet U_0403_crystals/LSE_1_MCU_0
LSE_2_MCU_0: IC10.10(PC15-OSC32_OUT(PC15)) ; sheet U_0403_crystals/LSE_2_MCU_0
MCU_0_NRESET: C68#2.1 IC10.31(NRST) R21.1 R27.1 U11#1.3(~{RESET}) X403.10 ; port POWER_GOOD
MCU_0_RTC_ALARM_OUT: IC10.8(PC13)
MCU_0_RTC_WAKEUP_IN: IC10.40(PA0-WKUP(PA0)) ; sheet U_0400_power/I2C_MCU_0_RTC_INT  [project net GPIO.RTC_INT#]
MCU_0_SWCLK: IC10.137(PA14(JTCK-SWCLK)) X403.4
MCU_0_SWDIO: IC10.124(PA13(JTMS-SWDIO)) X403.2
MCU_0_SWO: IC10.161(PB3(JTDO/TRACESWO)) X403.6
MCU_0_TDI: IC10.138(PA15(JTDI)) X403.8
MCU_TO_FPGA_INTERFACE_MCU_0_CS: IC10.24(PF6) ; port MCU_TO_FPGA_INTERFACE.CS
MCU_TO_FPGA_INTERFACE_MCU_0_MISO: IC10.26(PF8) ; port MCU_TO_FPGA_INTERFACE.MISO
MCU_TO_FPGA_INTERFACE_MCU_0_MOSI: IC10.27(PF9) ; port MCU_TO_FPGA_INTERFACE.MOSI
MCU_TO_FPGA_INTERFACE_MCU_0_SCK: IC10.25(PF7) ; port MCU_TO_FPGA_INTERFACE.SCK
MCU_TO_MCU_INTERFACE_MCU_0_CS: IC10.163(PB5) ; port MCU_TO_MCU_MCU0.CS
MCU_TO_MCU_INTERFACE_MCU_0_MISO: IC10.94(PB14) ; port MCU_TO_MCU_MCU0.MISO
MCU_TO_MCU_INTERFACE_MCU_0_MOSI: IC10.95(PB15) ; port MCU_TO_MCU_MCU0.MOSI
MCU_TO_MCU_INTERFACE_MCU_0_SCK: IC10.145(PD3) ; port MCU_TO_MCU_MCU0.SCK
Memory_SUPPLY_CONTROL: IC10.33(PC1) ; port DATA_STORAGE_SPI.Memory_SUPPLY_CONTROL
PIEZO_MCU_0_PWM: IC10.47(PA3) R62#2.2
RS485_MCU_0_DE: IC10.107(PG3) ; port RS485_MCU_0.DE  [project net RS485_DE]
RS485_MCU_0_NRE: IC10.106(PG2) ; port RS485_MCU_0.NRE
RS485_MCU_0_RX: IC10.121(PA10) ; port RS485_MCU_0.RX
RS485_MCU_0_TX: IC10.120(PA9) ; port RS485_MCU_0.TX
TRACECLK_MCU_0: IC10.1(PE2) X403.12
TRACED0_MCU_0: IC10.2(PE3) X403.14
TRACED1_MCU_0: IC10.3(PE4) X403.16
TRACED2_MCU_0: IC10.4(PE5) X403.18
TRACED3_MCU_0: IC10.5(PE6) X403.20
NetC60_1: C60.1 IC10.125(VCAP_2)
NetC88_1: C88.1 IC10.81(VCAP_1)
NetIC10_58: IC10.58(PB2-BOOT1(PB2)) R66#2.2
NetLS1_2: LS1.2 R61.1 T7#1.D
NetR20_2: R20.2 S401.1 S401.2
NetR21_2: R21.2 R22.1
NetR62#2_1: R62#2.1 R63#2.2 T7#1.G
NetS401_3: S401.3 S401.4 U11#1.4(~{MR})

Not connected (* = marked no-connect by the designer): IC10 12(PI10)* 13(PI11)* 28(PF10)* 43(PH2)* 46(PH5)* 110(PG6)* 151(PD7)* 176(PI7)*

### Buses and harness runs
bus ADC_MCU_0_CH_[0..4] = port ADC_MCU_0_CH_[0..4]
bus BMS-INTERFACE_0_GPIO_[0..3]
bus FMC_MCU_0_RAM_A[0..11]
bus FMC_MCU_0_RAM_BA[0..1]
bus FMC_MCU_0_RAM_D[0..15]
bus FMC_MCU_0_RAM_NBL[0..1]

### Notes on the sheet
- (near X403) ARM Cortex Debug Connector 1.27mm
- Fraunhofer IISB
- Schottkystr. 10
- developed by:
- 91058 Erlangen
- Germany
- Author
- Project
- License
- Description
- File
- Version
- Release Date
- Sheet
- www.foxbms.org
- www.iisb.fraunhofer.de
- foxBMS Team
- /

### Library data of the parts
C41 C68#2 = gen_C_ceramic_100n_50V_X7R_0603: Ceramic, 100nF, ±10%, 50V, X7R, –55 to 125°C, 0603 (1608),RoHS, Automotive; Part Number: GCJ188R71H104KA12; Manufacturer: Murata; Capacitance: 100n; Case EIA: 0603; Case Metric: 1608; PnP Package: C_0603_10; PnP Value: 100nF/50V/X7R; PnP equipped: x; Automotive Qualified: True; Rated Voltage: 50V; Dielectric: X7R; Supplier 1: Digi-Key; Supplier Part Number 1: 490-5798-1-ND; Height - Seated (Max): 0.8mm; Mounting Type: SurfaceMount,MLCC; Operating Temperature: –55 to 125°C; Series: GCJ; Tolerance: ±10%; Manufacturer_Part_Number: GCJ188R71H104KA12
C60 C88 = gen_C_ceramic_2u2_50V_X7R_0805: Ceramic, 2.2µF, ±10%, 25V, X7R, –55 to 125°C, 0805 (2012),RoHS, Automotive; Part Number: GCJ21BR71E225KA01; Manufacturer: Murata; Capacitance: 2u2; Case EIA: 0805; Case Metric: 2012; Automotive Qualified: True; PnP Package: C_0805_10; PnP Value: 2.2µF/25V/X7R; Rated Voltage: 25V; Dielectric: X7R; Height - Seated (Max): 1.25mm; Mounting Type: SurfaceMount,MLCC; Operating Temperature: –55 to 125°C; Series: GCJ; Tolerance: ±10%; Manufacturer_Part_Number: GCJ21BR71E225KA01
IC10 = MC-ARM-STM32F4X9-SQ176: ARM Cortex-M4 32-bit MCU+FPU, 225 DMIPS, 2048 kB Flash, 256 kB Internal RAM, 140 I/Os, 176-pin LQFP, -40 to 85 degC, Tray; Manufacturer: STMicroelectronics; Internal RAM Size (kB): 256; I/Os (High Current): 140; FLASH Size (Prog) (kB): 2048; D/A Converter: 2x12-bit; Supply Voltage(Vcc) max (V): 3.6; Operating Frequency(F) (Processor speed) (MHz): 180; Supply Voltage(Vcc) min (V): 1.8; Core: ARM Cortex-M4; PackageReference: LQFP176; ComponentLink1Description: Manufacturer URL; Packing: Tray; ComponentLink2Description: Datasheet; ComponentLink3Description: Package Specification; ComponentLink2URL: http://www.st.com/st-web-ui/static/active/en/resource/technical/document/data_brief/DM00053488.pdf; PackageVersion: Rev. 4, 06/2013; ComponentLink1URL: http://www.st.com/web/en/home.html; DatasheetVersion: Rev. 2; PartNumber: STM32F429IIT6; PackageDescription: 176-Pin Low Profile Quad Flat Package, 24 x 24 mm Body, 0.5 mm Pitch; ComponentLink3URL: http://www.st.com/st-web-ui/static/active/en/resource/technical/document/datasheet/DM00035129.pdf; Mounting Technology: Surface Mount; Part Number: STM32F429IIT6
LS1 = Speaker: Loudspeaker; ID: 17009; DBDesc: BUZZER PIEZO 4KHZ 12.2MM PC MNT, RoHS compliant
R20 R22 = gen_R_0R_0603: SMD Resistor 0R 0603; Power: 0.1W; Case EIA: 0603; Case Metric: 1608; PnP Package: R_0603; Maximum Working Voltage: 75V; Automotive Qualified: False; Part Number: gen_R_0R_0603; Operating Temperature: -55°C - +155°C; Resistance: 0R; Series: Jumper; PnP Value: 0R; Supplier 1: Farnell; Supplier Part Number 1: 2073345
R21 = gen_R_680R_0603: SMD Resistor 680R 0603; Tolerance: 1%; Power: 0.1W; Case EIA: 0603; Case Metric: 1608; Maximum Working Voltage: 75V; PnP Package: R_0603; Automotive Qualified: False; Part Number: gen_R_680R_0603; Operating Temperature: -55°C - +155°C; Resistance: 680R; Series: E24; PnP Value: 680R; Supplier 1: Farnell; Supplier Part Number 1: 2797303
R27 = gen_R_100k_0603: SMD Resistor 100k 0603; Case EIA: 0603; Case Metric: 1608; PnP Package: R_0603; Automotive Qualified: False; Part Number: gen_R_100k_0603; Operating Temperature: -55°C - +155°C; PnP Value: 100k
R61 = gen_R_10k_0603: SMD Resistor 1k 0603; Part Number: gen_R_1k_0603; Tolerance: 1%; Power: 0.1W; Case EIA: 0603; Case Metric: 1608; Maximum Working Voltage: 75V; PnP Package: R_0603; Automotive Qualified: False; Operating Temperature: -55°C - +155°C; Resistance: 1k; Series: E24, E96; PnP Value: 1k
R62#2 = gen_R_10R_0603: SMD Resistor 10R 0603; Tolerance: 1%; Power: 0.1W; Case EIA: 0603; Case Metric: 1608; Maximum Working Voltage: 75V; PnP Package: R_0603; Automotive Qualified: False; Part Number: gen_R_10R_0603; Operating Temperature: -55°C - +155°C; Resistance: 10R; Series: E24, E96; PnP Value: 10R; Supplier 1: Farnell; Supplier Part Number 1: 2073361
R63#2 R66#2 = gen_R_10k_0603: SMD Resistor 10k 0603; Tolerance: 1%; Power: 0.1W; Case EIA: 0603; Case Metric: 1608; Maximum Working Voltage: 75V; PnP Package: R_0603; Automotive Qualified: False; Part Number: gen_R_10k_0603; Operating Temperature: -55°C - +155°C; Resistance: 10k; Series: E24, E96; PnP Value: 10k; Supplier 1: Farnell; Supplier Part Number 1: 2073349
R72#1 R73 = gen_R_4K7_0603: SMD Resistor 4.7k 0603; Case EIA: 0603; Case Metric: 1608; PnP Package: R_0603; Automotive Qualified: False; PnP Value: 4k7; Operating Temperature: -55°C - +155°C; Part Number: gen_R_4k7_0603
S401 = KMR221GLFS: Microminiature Tactile Switch; Manufacturer: CK Components; Automotive Qualified: False; Part Number: KMR221GLFS; Operating Temperature: -40°C - +85°C; ComponentLink1Description: Datasheet; ComponentLink1URL: http://www.farnell.com/datasheets/1685525.pdf; Supplier 1: Farnell; Supplier Part Number 1: 1201424; Supplier 2: Digikey; Supplier Part Number 2: 401-1426-1-ND; Supplier 3: Mouser; Supplier Part Number 3: 611-KMR211G-LFS
T7#1 = IRLML0100TRPBF: MOSFET-Transistor, n-Kanal, 1.6 A, 100 V, 0.178 ohm, 10 V, 2.5 V; Manufacturer: Infineon; Maximum Drain-Source Voltage: 100V; Maximum Continous Drain Current (25°C): 1.6A; R_DS(on): 190m; Total Gate Charge: 2.5nC; Automotive Qualified: False; Part Number: IRLML0100TRPBF; Part Name: NMOS; Operating Temperature: -55°C - +150°C; ComponentLink1Description: Datasheet URL; ComponentLink1URL: http://www.farnell.com/datasheets/491501.pdf; Supplier 1: Farnell; Supplier Part Number 1: 1783928
U11#1 = CMP-0063-01088-2: 5-Pin Microprocessor Reset Circuits, 5-pin SOT-23, Pb-Free; Manufacturer: National Semiconductor; PowerWise: N; PackageTopMarking: R53B*XTT; CompType: MiscPower; PackageVersion: revD, Aug-2008; ComponentLink3URL: http://www.national.com/packaging/folders/mf05a.html; ComponentLink2URL: http://www.national.com/pf/LM/LM3724.html; PinCount: 5; ComponentLink2Description: LM3724 Web Page; PackageDescription: Molded SOT-23, .115 x .063 x .040 in Body, 5 Lead, .0375 in Pitch; ComponentLink3Description: MF05A Package Page; ComponentLink1Description: LM3724 Datasheet; RevisionNote: Component URLs added; RoHS: Y; ComponentLink1URL: http://www.national.com/ds/LM/LM3724.pdf; DatasheetVersion: Jul-2007; PackageReference: MF05A
X403 = samtec_FTSH-110-01-L-DV-007-K-P: Board-To-Board Connector, ARM Cortex Debug Header 20 Pin; Manufacturer: Samtec; Circuits: 20; Automotive Qualified: False; Part Number: samtec_FTSH-110-01-L-DV-007-K-P; Part Name: FTSH-110-01-L-DV-007-K-P; Operating Temperature: -55°C - +125°C; Supplier 1: Digikey; Supplier Part Number 1: SAM11268-ND; Supplier 2: Avnet; Supplier Part Number 2: FTSH-110-01-L-DV-007-K-P

## Sheet crystals.SchDoc
size A3; DocumentNumber: 8; SheetNumber: 8; SheetTotal: 24; SheetDescription: Crystals for MCU0
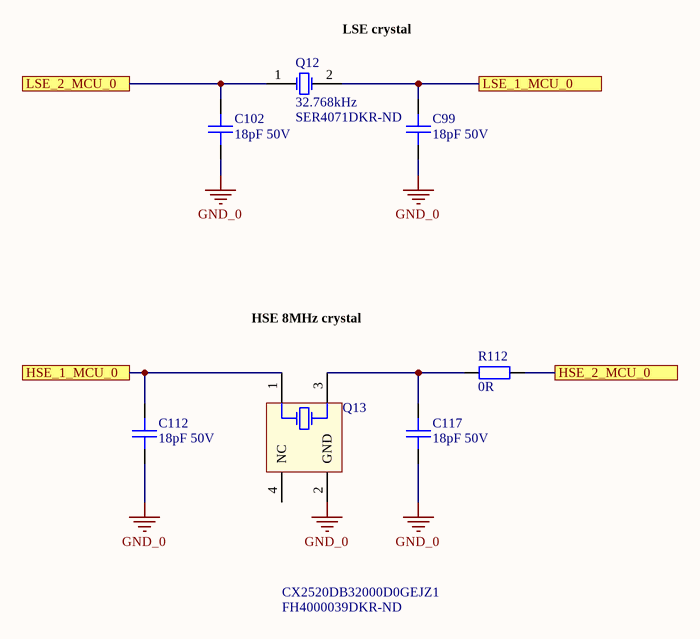
[diagram p9: crystals.SchDoc]

### Parts
(Parts that share a designator on the sheet are numbered #1, #2 ... from top to bottom, then left to right.)
C99#1  18pF 50V  [0402C]
C102#1  18pF 50V  [0402C]
C112  18pF 50V  [0402C]
C117#1  18pF 50V  [0402C]
Q12#1  32.768kHz  Supplier Part Number 1: SER4071DKR-ND  [ESPO-FC-135-2_V]
Q13#1  CX2520DB32000D0GEJZ1  Supplier Part Number 1: FH4000039DKR-ND  [AVX-CX2520DB32000D0GEJZ1-4_V]
R112  0R  [0402R]

### Ports
HSE_1_MCU_0, HSE_2_MCU_0, LSE_1_MCU_0, LSE_2_MCU_0

### Nets
GND_0: C99#1.1 C102#1.2 C112.1 C117#1.2 Q13#1.2(GND)  [project net GND]
HSE_1_MCU_0: C112.2 Q13#1.1(HOT) ; port HSE_1_MCU_0
HSE_2_MCU_0: R112.1 ; port HSE_2_MCU_0
LSE_1_MCU_0: C99#1.2 Q12#1.2(X2) ; port LSE_1_MCU_0
LSE_2_MCU_0: C102#1.1 Q12#1.1(X1) ; port LSE_2_MCU_0
NetC117#1_1: C117#1.1 Q13#1.3(HOT) R112.2

Not connected (* = marked no-connect by the designer): Q13#1 4(NC)

### Notes on the sheet
- (near Q12#1) LSE crystal
- HSE 8MHz crystal
- Fraunhofer IISB
- Schottkystr. 10
- developed by:
- 91058 Erlangen
- Germany
- Author
- Project
- License
- Description
- File
- Version
- Release Date
- Sheet
- www.foxbms.org
- www.iisb.fraunhofer.de
- foxBMS Team
- /

### Library data of the parts
C99#1 C102#1 C112 C117#1 = gen_C_ceramic_18p_50V_C0G_0402: Ceramic, 18pF, ±5%, 50V, X7R, 25 to 125°C, 0402 (1005),RoHS, Automotive; Part Number: GCM1555C1H180JA16#; Manufacturer: Murata; Capacitance: 18p; Dielectric: C0G; Case EIA: 0402; Case Metric: 1005; Automotive Qualified: True; PnP Package: C_0402_10; PnP Value: 18pF/50V/X7R; Rated Voltage: 50V; Supplier 1: Digi-Key; Supplier Part Number 1: 490-12650-1-ND; Height - Seated (Max): 0.5mm; Mounting Type: SurfaceMount,MLCC; Operating Temperature: 25 to 125°C; Series: GCM; Tolerance: ±5%; Manufacturer_Part_Number: GCM1555C1H180JA16#
Q12#1 = CMP-2000-05107-1: Crystal, 32.768 KHz, 12.5 pF, -40 to 85 degC, 2-Pin SMD, RoHS, Tape and Reel; Manufacturer: Epson; Load Capacitance: 12.5pF; Frequency Stability: 20PPM; Drive Level: 0.5uW; Type: kHzCrystal; Unit Weight: 0.000564oz; Brand: EpsonTiming; ESR: 65kOhms; Series: FC-135R/FC-135/FC-255; Height: 0.8mm; Operating Temperature Range: -40Cto+85C; Package / Case: 3.2mmx1.5mm; Factory Pack Quantity: 250; Product Category: Crystals; Frequency: 32.768kHz; Package Description: 2-Pin Surface Mount Device, Body 3.2 x 1.5 mm; Width: 1.5mm; RoHS: True; Manufacturer URL: https://www.eea.epson.com/; Package Reference: FC-135; Datasheet Version: Nov-12; Tolerance: 20PPM; Mounting Style: SMD/SMT; Length: 3.2mm; Termination Style: SMD/SMT; Packaging: Reel; Datasheet URL: https://datasheet.ciiva.com/15116/getdatasheetpartid-112713-15116373.pdf; Supplier 1: Digi-Key
Q13#1 = CMP-0449-00001-1: Crystal,CRYSTAL 40MHZ 15PF 85degC Surface Mount 2.5 x 2.0 mm; Manufacturer: Kyocera; Drive Level: 10uW (100uW max.); Motional Series Resistance: 50 ohm (max); Frequency Range: 32000 kHz; Load Capacitance: 8 pF; Packing: Tape and Reel; ComponentLink2URL: http://global.kyocera.com/prdct/electro/pdf/xtal/cx2520db_cs_e.pdf; ComponentLink1Description: Manufacturer URL; PackageDescription: 4-Pin Hand Drawnï¼ŒBody 2.5x2mm; ComponentLink1URL: http://global.kyocera.com/; ComponentLink3URL: http://global.kyocera.com/prdct/electro/pdf/xtal/cx2520db_cs_e.pdf; ComponentLink2Description: Datasheet; PackageReference: CX2520DB32000D0GEJZ1-4; Operating Temperature: -10 to 70 degC; PartNumber: CX2520DB32000D0GEJZ1; ComponentLink3Description: Package Specification; Mounting Technology: Surface Mount; Supplier 1: Digi-Key
R112 = gen_R_0R_0402: SMD Resistor 0R 0402; Case EIA: 0402; Case Metric: 1005; PnP Package: R_0402; Automotive Qualified: False; Part Number: gen_R_0R_0402; PnP Value: 0R; Operating Temperature: -55°C - +155°C

## Sheet debug_LED.SchDoc
size A3; DocumentNumber: 9; SheetNumber: 9; SheetTotal: 24; SheetDescription: Debug LEDs for MCU0
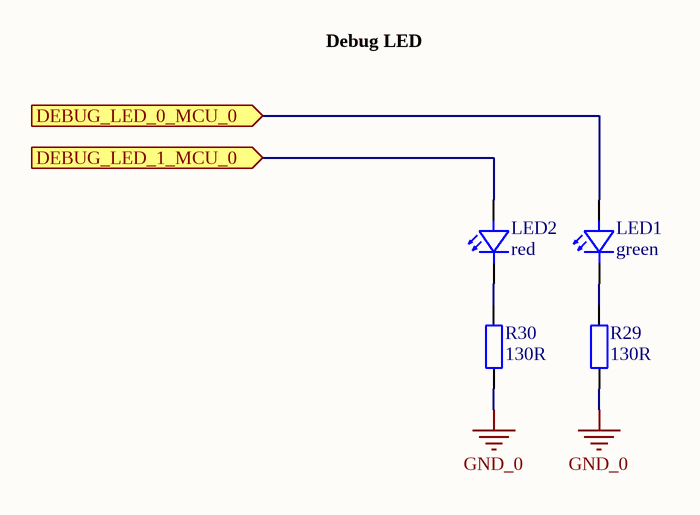
[diagram p10: debug_LED.SchDoc]

### Parts
LED1  green  [LEDC1608X07N]
LED2  red  [LEDC1608X07N]
R29  130R  [0603R]
R30  130R  [0603R]

### Ports
DEBUG_LED_0_MCU_0 (in), DEBUG_LED_1_MCU_0 (in)

### Nets
GND_0: R29.1 R30.1  [project net GND]
DEBUG_LED_0_MCU_0: LED1.2(A) ; port DEBUG_LED_0_MCU_0
DEBUG_LED_1_MCU_0: LED2.2(A) ; port DEBUG_LED_1_MCU_0
NetLED1_1: LED1.1(C) R29.2
NetLED2_1: LED2.1(C) R30.2

### Notes on the sheet
- Debug LED
- Fraunhofer IISB
- Schottkystr. 10
- developed by:
- 91058 Erlangen
- Germany
- Author
- Project
- License
- Description
- File
- Version
- Release Date
- Sheet
- www.foxbms.org
- www.iisb.fraunhofer.de
- foxBMS Team
- /

### Library data of the parts
LED1 = gen_LED_0603_green: LED; Breakdown Voltage: 5V; Continuous Forward Current: 20mA; Forward Voltage @ 20mA: 2.2V; Automotive Qualified: False; Case EIA: 0603; Case Metric: 1608; Part Number: gen_LED_0603_green; Color: green; PnP Package: LED_0603; Supplier 1: Farnell; Supplier Part Number 1: 2099223
LED2 = gen_LED_0603_red: LED; Breakdown Voltage: 5V; Continuous Forward Current: 20mA; Forward Voltage @ 20mA: 2V; Automotive Qualified: False; Case EIA: 0603; Case Metric: 1608; Part Number: gen_LED_0603_red; Color: red; PnP Package: LED_0603; Supplier 1: Farnell; Supplier Part Number 1: 2099221
R29 R30 = gen_R_130R_0603: SMD Resistor 130R 0603; Tolerance: 1%; Power: 0.1W; Case EIA: 0603; Case Metric: 1608; Maximum Working Voltage: 75V; PnP Package: R_0603; Automotive Qualified: False; Part Number: gen_R_130R_0603; Operating Temperature: -55°C - +155°C; Resistance: 130R; Series: E24, E96; PnP Value: 130R; Supplier 1: Farnell; Supplier Part Number 1: 2379959

## Sheet ext_bootload_activation.SchDoc
size A3; DocumentNumber: 10; SheetNumber: 10; SheetTotal: 24; SheetDescription: External Bootload Activation Circuit
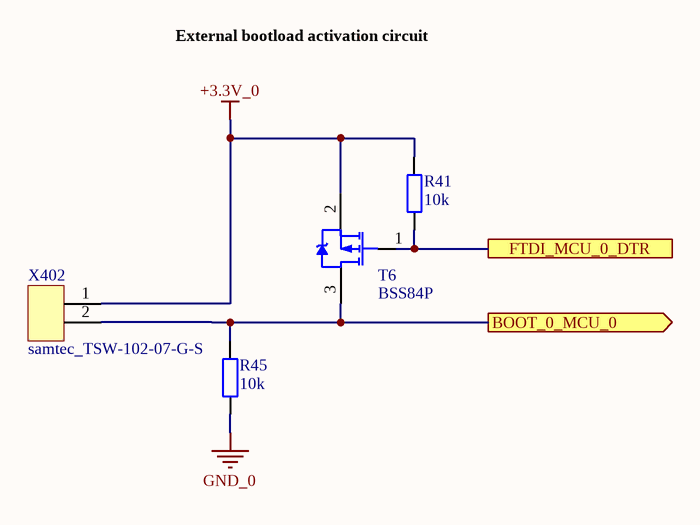
[diagram p11: ext_bootload_activation.SchDoc]

### Parts
(Parts that share a designator on the sheet are numbered #1, #2 ... from top to bottom, then left to right.)
R41#1  10k  [0603R]
R45  10k  [0603R]
T6#1  BSS84P  [INF-PG-SOT23_N]
X402  samtec_TSW-102-07-G-S  [Pinheader_2.54_2]

### Ports
BOOT_0_MCU_0 (out), FTDI_MCU_0_DTR

### Nets
+3.3V_0: R41#1.2 T6#1.2(SOURCE) X402.1
GND_0: R45.1  [project net GND]
BOOT_0_MCU_0: R45.2 T6#1.3(DRAIN) X402.2 ; port BOOT_0_MCU_0
FTDI_MCU_0_DTR: R41#1.1 T6#1.1(GATE) ; port FTDI_MCU_0_DTR

### Notes on the sheet
- External bootload activation circuit
- Fraunhofer IISB
- Schottkystr. 10
- developed by:
- 91058 Erlangen
- Germany
- Author
- Project
- License
- Description
- File
- Version
- Release Date
- Sheet
- www.foxbms.org
- www.iisb.fraunhofer.de
- foxBMS Team
- /

### Library data of the parts
R41#1 R45 = gen_R_10k_0603: as R63#2 on sheet mcu0_primary; Part Number: gen_R_10k_0603; Operating Temperature: -55°C - +155°C; Resistance: 10k; Series: E24, E96; PnP Value: 10k; Supplier 1: Farnell; Supplier Part Number 1: 2073349
T6#1 = CMP-1099-00028-1: P-Channel SIPMOS Small-Signal-Transistor, -60 V VDS, -0.17 A ID, -55 to 150 degC, PG-SOT23, Reel, Green; Manufacturer: Infineon; VGS(th) (max): -2Â V; VGS(th) (min): -1Â V; VDS (max): -60Â V; Rth: 350Â K/W; Pto t (max): 0.36Â W; ID (max): -0.17Â A; IDpuls (max): -0.68Â A; RDS (on) (max) (@4.5V): 12,000Â mOhm; QG: 1Â nC; Green: TRUE; RDS (on) (max): 8,000Â mOhm; ComponentLink3URL: http://www.infineon.com/dgdl/SOT23-Package_Overview.pdf?folderId=db3a30431936bc4b0119532290053c66&fileId=db3a30431936bc4b0119533468123c85; ComponentLink3Description: Package Specification; Packing: Reel; PartNumber: BSS84P; ComponentLink2Description: Datasheet; Mounting Technology: Surface Mount; ComponentLink2URL: http://www.infineon.com/dgdl/BSS84P_Rev2.7%5B1%5D.pdf?folderId=db3a304314dca38901154a72e3951a65&fileId=db3a304330f68606013118ac7a9b4549; PackageReference: PG-SOT23; ComponentLink1URL: http://www.infineon.com/; PackageVersion: Apr-08; ComponentLink1Description: Manufacturer URL; PackageDescription: 3-Pin Small Outline Transistor Package, 2.9 x 1.3 mm Body, 0.95 mm Pitch; Halogen-free: TRUE; DatasheetVersion: Rev. 2.7
X402 = samtec_TSW-102-07-G-S: Board-To-Board Connector, Vertical, 2.54 mm, 2 Contacts, Header, TSW Series, Through Hole, 1 Row; Manufacturer: Samtec; Circuits: 2; Automotive Qualified: False; Part Number: samtec_TSW-102-07-G-S; Part Name: TSW-102-07-G-S; Operating Temperature: -55°C - +125°C; ComponentLink1Description: Datasheet; ComponentLink1URL: http://www.farnell.com/datasheets/1796313.pdf; Supplier 1: Farnell; Supplier Part Number 1: 2505044